# Altium schematic sheet NodoWifi_PER_R00.SchDoc
size A4; SheetNumber: 5; SheetTotal: 5
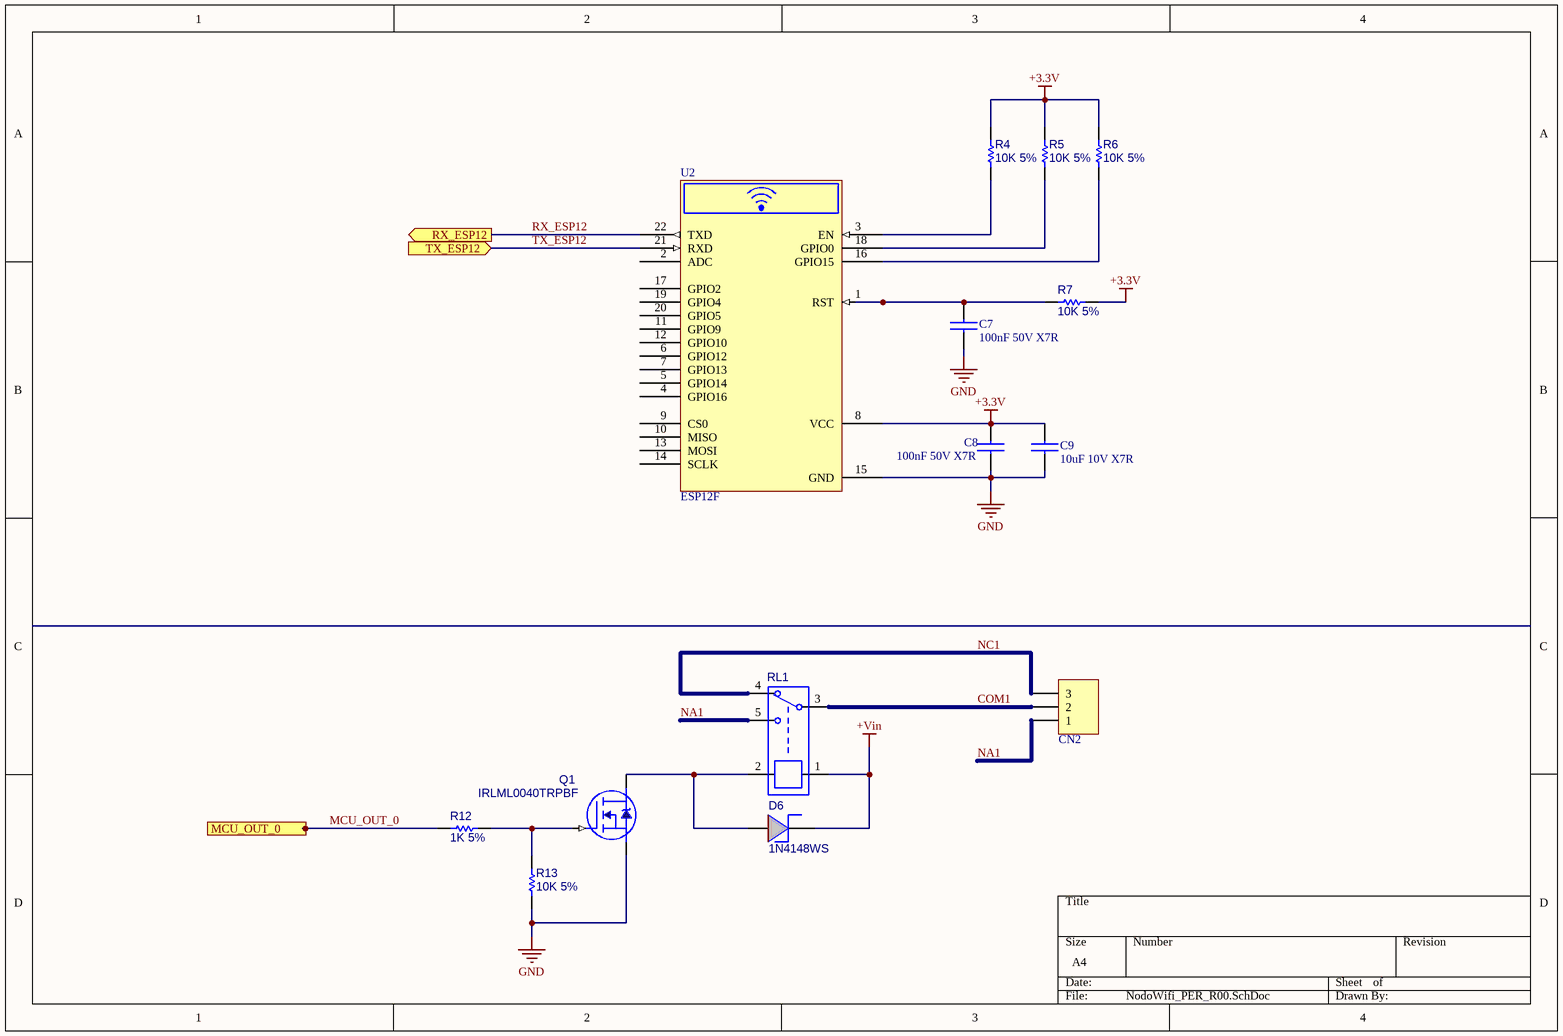
[diagram p0: NodoWifi_PER_R00.SchDoc]

## Parts
C7  100nF 50V X7R  [C_0805]
C8  100nF 50V X7R  [C_0805]
C9  10uF 10V X7R  [C_0805]
CN2  Bornera 3 Vias Pitch 5mm  [TerminalBlock_1x3_P5mm]  (value not drawn)
D6  1N4148WS  [SOD_323]
Q1  IRLML0040TRPBF  [SOT_23]
R4  10K 5%  [R_0805]
R5  10K 5%  [R_0805]
R6  10K 5%  [R_0805]
R7  10K 5%  [R_0805]
R12  1K 5%  [R_0805]
R13  10K 5%  [R_0805]
RL1  SRD-24VDC-SLC  [943-1C]  (value not drawn)
U2  ESP12F  [ESP12F]

## Ports
MCU_OUT_0 (in, see NodoWifi_BLK_R00[3C], NodoWifi_CPU1[3A]), RX_ESP12 (out, see NodoWifi_BLK_R00[3C], NodoWifi_CPU1[3B]), TX_ESP12 (in, see NodoWifi_BLK_R00[3C], NodoWifi_CPU1[3B])

## Nets
+3.3V: C8.1 C9.1 R4.2 R5.2 R6.2 R7.1 U2.8(VCC)
+Vin: D6.2(K) RL1.1
GND: C7.2 C8.2 C9.2 Q1.2(SOURCE) R13.1 U2.15(GND)
COM1: CN2.2 RL1.3
MCU_OUT_0: R12.2 ; port MCU_OUT_0
NA1: CN2.1 RL1.5
NC1: CN2.3 RL1.4
RX_ESP12: U2.22(TXD) ; port RX_ESP12
TX_ESP12: U2.21(RXD) ; port TX_ESP12
NetC7_1: C7.1 R7.2 U2.1(RST)
NetD6_1: D6.1(A) Q1.3(DRAIN) RL1.2
NetQ1_1: Q1.1(GATE) R12.1 R13.2
NetR4_1: R4.1 U2.3(EN)
NetR5_1: R5.1 U2.18(GPIO0)
NetR6_1: R6.1 U2.16(GPIO15)

Not connected (* = marked no-connect by the designer): U2 2(ADC) 4(GPIO16) 5(GPIO14) 6(GPIO12) 7(GPIO13) 9(CS0) 10(MISO) 11(GPIO9) 12(GPIO10) 13(MOSI) 14(SCLK) 17(GPIO2) 19(GPIO4) 20(GPIO5)

## Library data of the parts
C7-C9 = Ceramic Capacitor
CN2 = CONN_03P: Connector Generic 3 Vias
D6 = DIODO_SH: Diode Shottky
Q1 = N_MOSFET_SOT23: Mosfet N-Ch
R4-R7 R12 R13 = Res1: Resistor
RL1 = RELAY SPDT
U2 = ESP12F Wifi Module: Wifi Module